# EAGLE design linear supply3_smd (EAGLE 9.6.2)
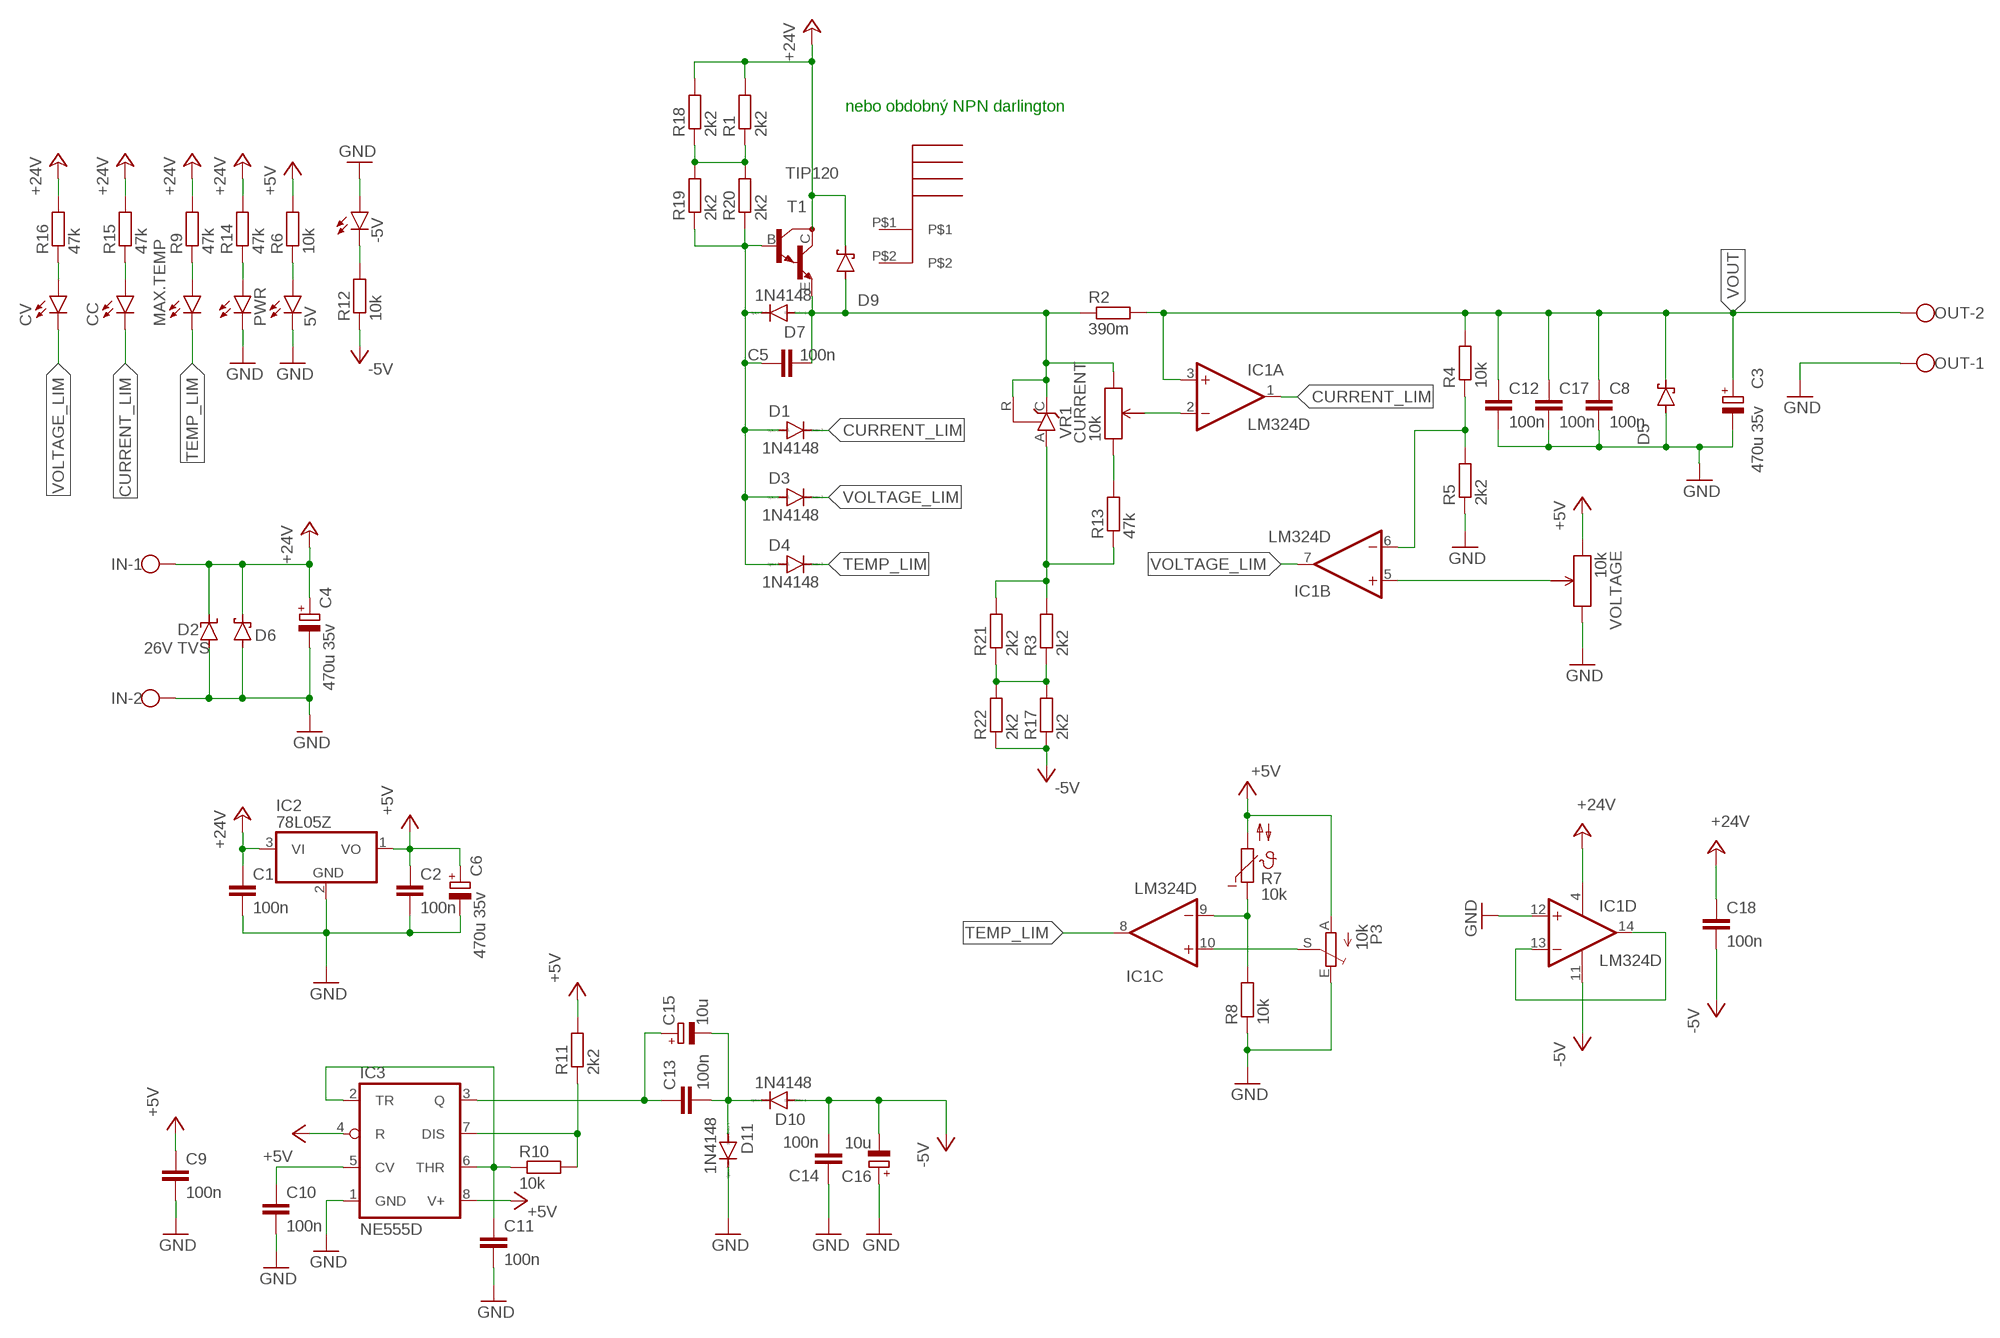
[diagram p0: schematic, sheet 1]

## Parts
5V  LEDCHIP-LED0805  [CHIP-LED0805]
-5V  LEDCHIP-LED0805  [CHIP-LED0805]
C1  100n  C-EUC0805  [C0805]
C2  100n  C-EUC0805  [C0805]
C3  470u 35v  CPOL-EUE5-10.5  [E5-10,5]
C4  470u 35v  CPOL-EUE5-10.5  [E5-10,5]
C5  100n  C-EUC0805  [C0805]
C6  470u 35v  CPOL-EUE5-10.5  [E5-10,5]
C8  100n  C-EU050-050X075  [C050-050X075]
C9  100n  C-EUC0805  [C0805]
C10  100n  C-EUC0805  [C0805]
C11  100n  C-EUC0805  [C0805]
C12  100n  C-EUC1206  [C1206]
C13  100n  C-EUC0805  [C0805]
C14  100n  C-EUC0805  [C0805]
C15  10u  CPOL-EUE2.5-6  [E2,5-6]
C16  10u  CPOL-EUE2.5-6  [E2,5-6]
C17  100n  C-EUC1206  [C1206]
C18  100n  C-EUC0805  [C0805]
CC  LEDCHIP-LED0805  [CHIP-LED0805]
CURRENT  10k  THRU_PCB_POTKASO1  [THRU_PCW_POT]
CV  LEDCHIP-LED0805  [CHIP-LED0805]
D1  1N4148  PMLL4150  [SOD80C]
D2  26V TVS  SUPPRESSOR-SMBJ  [SMBJ]
D3  1N4148  PMLL4150  [SOD80C]
D4  1N4148  PMLL4150  [SOD80C]
D5  SCHOTTKY-DIODESMC  [SMC]
D6  SCHOTTKY-DIODESMC  [SMC]
D7  1N4148  PMLL4150  [SOD80C]
D9  SCHOTTKY-DIODESMC  [SMC]
D10  1N4148  PMLL4150  [SOD80C]
D11  1N4148  PMLL4150  [SOD80C]
IC1  LM324D  [SO14]
IC2  78L05Z  [TO92]
IC3  NE555D  [SO08]
IN  W237-102  [W237-102]
MAX.TEMP  LEDCHIP-LED0805  [CHIP-LED0805]
OUT  W237-102  [W237-102]
P3  10k  TRIM_EU-CA6V  [CA6V]
PWR  LEDCHIP-LED0805  [CHIP-LED0805]
R1  2k2  R-EU_R0805  [R0805]
R2  390m  R-EU_0411/12  [0411/12]
R3  2k2  R-EU_R0805  [R0805]
R4  10k  R-EU_R0805  [R0805]
R5  2k2  R-EU_R0805  [R0805]
R6  10k  R-EU_R0805  [R0805]
R7  10k  V642  [P642]
R8  10k  R-EU_R0805  [R0805]
R9  47k  R-EU_R0805  [R0805]
R10  10k  R-EU_R0805  [R0805]
R11  2k2  R-EU_R0805  [R0805]
R12  10k  R-EU_R0805  [R0805]
R13  47k  R-EU_R0805  [R0805]
R14  47k  R-EU_R0805  [R0805]
R15  47k  R-EU_R0805  [R0805]
R16  47k  R-EU_R0805  [R0805]
R17  2k2  R-EU_R0805  [R0805]
R18  2k2  R-EU_R0805  [R0805]
R19  2k2  R-EU_R0805  [R0805]
R20  2k2  R-EU_R0805  [R0805]
R21  2k2  R-EU_R0805  [R0805]
R22  2k2  R-EU_R0805  [R0805]
T1  TIP120  BDV65  [SOT93]
U$1  RAD-DY-KY/3  [RAD-DY-KY/3HEATSINK]
VOLTAGE  10k  THRU_PCB_POTKASO1  [THRU_PCW_POT]
VR1  TL431CLP  [TO92-CLP]

## Nets
+5V: C2.1 C6.+ C9.1 IC2.1(VO) IC3.4(R) IC3.8(V+) P3.A R6.2 R7.2 R11.2 VOLTAGE.P$1
+24V: C1.1 C4.+ C18.1 D2.C D6.C D9.C IC1.4(P:V+) IC2.3(VI) IN.1 R1.2 R9.2 R14.2 R15.2 R16.2 R18.2 T1.C
-5V: C14.2 C16.- C18.2 D10.A IC1.11(P:V-) R12.1 R17.1 R22.1
CURRENT_LIM: CC.C D1.C IC1.1(A:OUT)
GND: 5V.C -5V.A C1.2 C2.2 C3.- C4.- C6.- C8.2 C9.2 C10.2 C11.2 C12.2 C14.1 C16.+ C17.2 D2.A D5.A D6.A D11.C IC1.12(D:+IN) IC2.2(GND) IC3.1(GND) IN.2 OUT.1 P3.E PWR.C R5.1 R8.1 VOLTAGE.P$3
MAX: R3.2 R13.1 R21.2 VR1.A
MIN: C5.2 CURRENT.P$3 D7.A D9.A R2.1 T1.E VR1.C VR1.R
N$1: C5.1 D1.A D3.A D4.A D7.C R19.1 R20.1 T1.B
N$2: PWR.A R14.1
N$3: C11.1 IC3.2(TR) IC3.6(THR) R10.1
N$4: IC1.9(C:-IN) R7.1 R8.2
N$5: IC1.6(B:-IN) R4.1 R5.2
N$6: 5V.A R6.1
N$7: IC1.5(B:+IN) VOLTAGE.P$2
N$8: IC1.10(C:+IN) P3.S
N$9: CURRENT.P$2 IC1.2(A:-IN)
N$10: MAX.TEMP.A R9.1
N$11: IC1.13(D:-IN) IC1.14(D:OUT)
N$12: IC3.7(DIS) R10.2 R11.1
N$13: C13.1 C15.+ IC3.3(Q)
N$14: C10.1 IC3.5(CV)
N$15: C13.2 C15.- D10.C D11.A
N$16: -5V.C R12.2
N$17: CURRENT.P$1 R13.2
N$18: CC.A R15.1
N$19: CV.A R16.1
N$23: R1.1 R18.1 R19.2 R20.2
N$26: R3.1 R17.2 R21.1 R22.2
TEMP_LIM: D4.C IC1.8(C:OUT) MAX.TEMP.C
VOLTAGE_LIM: CV.C D3.C IC1.7(B:OUT)
VOUT: C3.+ C8.1 C12.1 C17.1 D5.C IC1.3(A:+IN) OUT.2 R2.2 R4.2
Unconnected: U$1.P$1 U$1.P$2

## Notes on the sheet
- nebo obdobný NPN darlington

## Library data of the parts
5V -5V CC CV MAX.TEMP PWR = led:LED: LED OSRAM: - CHIPLED LG R971, LG N971, LY N971, LG Q971, LY Q971, LO R971, LY R971 LH N974, LH R974 LS Q976, LO Q976, LY Q976 LO Q996 - Hyper CHIPLED LW Q18S LB Q993, LB Q99A, LB R99A - SideLED LS A670, LO A670, LY A670, LG A670, LP A670 LB A673, LV A673, LT A673, LW A673 LH A674 LY A675 LS A676, LA A676, LO A676, LY A676, LW A676 LS A679, LY A679, LG A679 - Hyper Micro SIDELED® LS Y876, LA Y876, LO Y876, LY Y876 LT Y87S - SmartLED LW L88C, LW L88S LB L89C, LB L89S, LG L890 LS L89K, LO L89K, LY L89K LS L896, LA L896, LO L896, LY L896 - TOPLED LS T670, LO T670, LY T670, LG T670, LP T670 LSG T670, LSP T670, LSY T670, LOP T670, LYG T670 LG T671, LOG T671, LSG T671 LB T673, LV T673, LT T673, LW T673 LH T674 LS T676, LA T676, LO T676, LY T676, LB T676, LH T676, LSB T676, LW T676 LB T67C, LV T67C, LT T67C, LS T67K, LO T67K, LY T67K, LW E67C LS E67B, LA E67B, LO E67B, LY E67B, LB E67C, LV E67C, LT E67C LW T67C LS T679, LY T679, LG T679 LS T770, LO T770, LY T770, LG T770, LP T770 LB T773, LV T773, LT T773, LW T773 LH T774 LS E675, LA E675, LY E675, LS T675 LS T776, LA T776, LO T776, LY T776, LB T776 LHGB T686 LT T68C, LB T68C - Hyper Mini TOPLED® LB M676 - Mini TOPLED Santana® LG M470 LS M47K, LO M47K, LY M47K Source: http://www.osram.convergy.de LUXEON: - LUMILED® LXK2-PW12-R00, LXK2-PW12-S00, LXK2-PW14-U00, LXK2-PW14-V00 LXK2-PM12-R00, LXK2-PM12-S00, LXK2-PM14-U00 LXK2-PE12-Q00, LXK2-PE12-R00, LXK2-PE12-S00, LXK2-PE14-T00, LXK2-PE14-U00 LXK2-PB12-K00, LXK2-PB12-L00, LXK2-PB12-M00, LXK2-PB14-N00, LXK2-PB14-P00, LXK2-PB14-Q00 LXK2-PR12-L00, LXK2-PR12-M00, LXK2-PR14-Q00, LXK2-PR14-R00 LXK2-PD12-Q00, LXK2-PD12-R00, LXK2-PD12-S00 LXK2-PH12-R00, LXK2-PH12-S00 LXK2-PL12-P00, LXK2-PL12-Q00, LXK2-PL12-R00 Source: www.luxeon.com KINGBRIGHT: KA-3528ASYC Source: www.kingbright.com
C1 C2 C5 C8-C14 C17 C18 = rcl:C-EU: CAPACITOR, European symbol; SPICEPREFIX: C
C3 C4 C6 C15 C16 = rcl:CPOL-EU: POLARIZED CAPACITOR, European symbol; SPICEPREFIX: C
CURRENT = SamacSys_Parts:THRU_PCB_POT
D1 D3 D4 D7 D10 D11 = diode:PMLL4150: DIODE high speed
D2 = diode:SUPPRESSOR-: Suppressor diode
D5 D6 D9 = diode:SCHOTTKY-DIODE: Schottky Diode
IC1 = linear:LM324: OP AMP
IC2 = linear:78*: Positive VOLTAGE REGULATOR Source: http://cache.national.com/ds/LM/LM78L05.pdf http://www.fairchildsemi.com/ds/LM/LM7805.pdf
IC3 = linear:*555: TIMER
IN OUT = con-wago-500:W237-102: WAGO SCREW CLAMP; MPN: 237-102; OC_FARNELL: unknown; OC_NEWARK: 70K9898
P3 = pot:TRIM_EU-: POTENTIOMETER
R1-R6 R8-R22 = rcl:R-EU_: RESISTOR, European symbol; SPICEPREFIX: R
R7 = ptc-ntc:V642: VALVO NTC; OC_FARNELL: unknown; OC_NEWARK: unknown
T1 = transistor-neu-to92:BDV65: NPN BIPOLAR DARLINGTON TRANSISTOR
U$1 = SamacSys_Parts:RAD-DY-KY/3
VOLTAGE = SamacSys_Parts:THRU_PCB_POT; SPICEPREFIX: J
VR1 = v-reg:TL431CLP: VOLTAGE REGULATOR

## Board
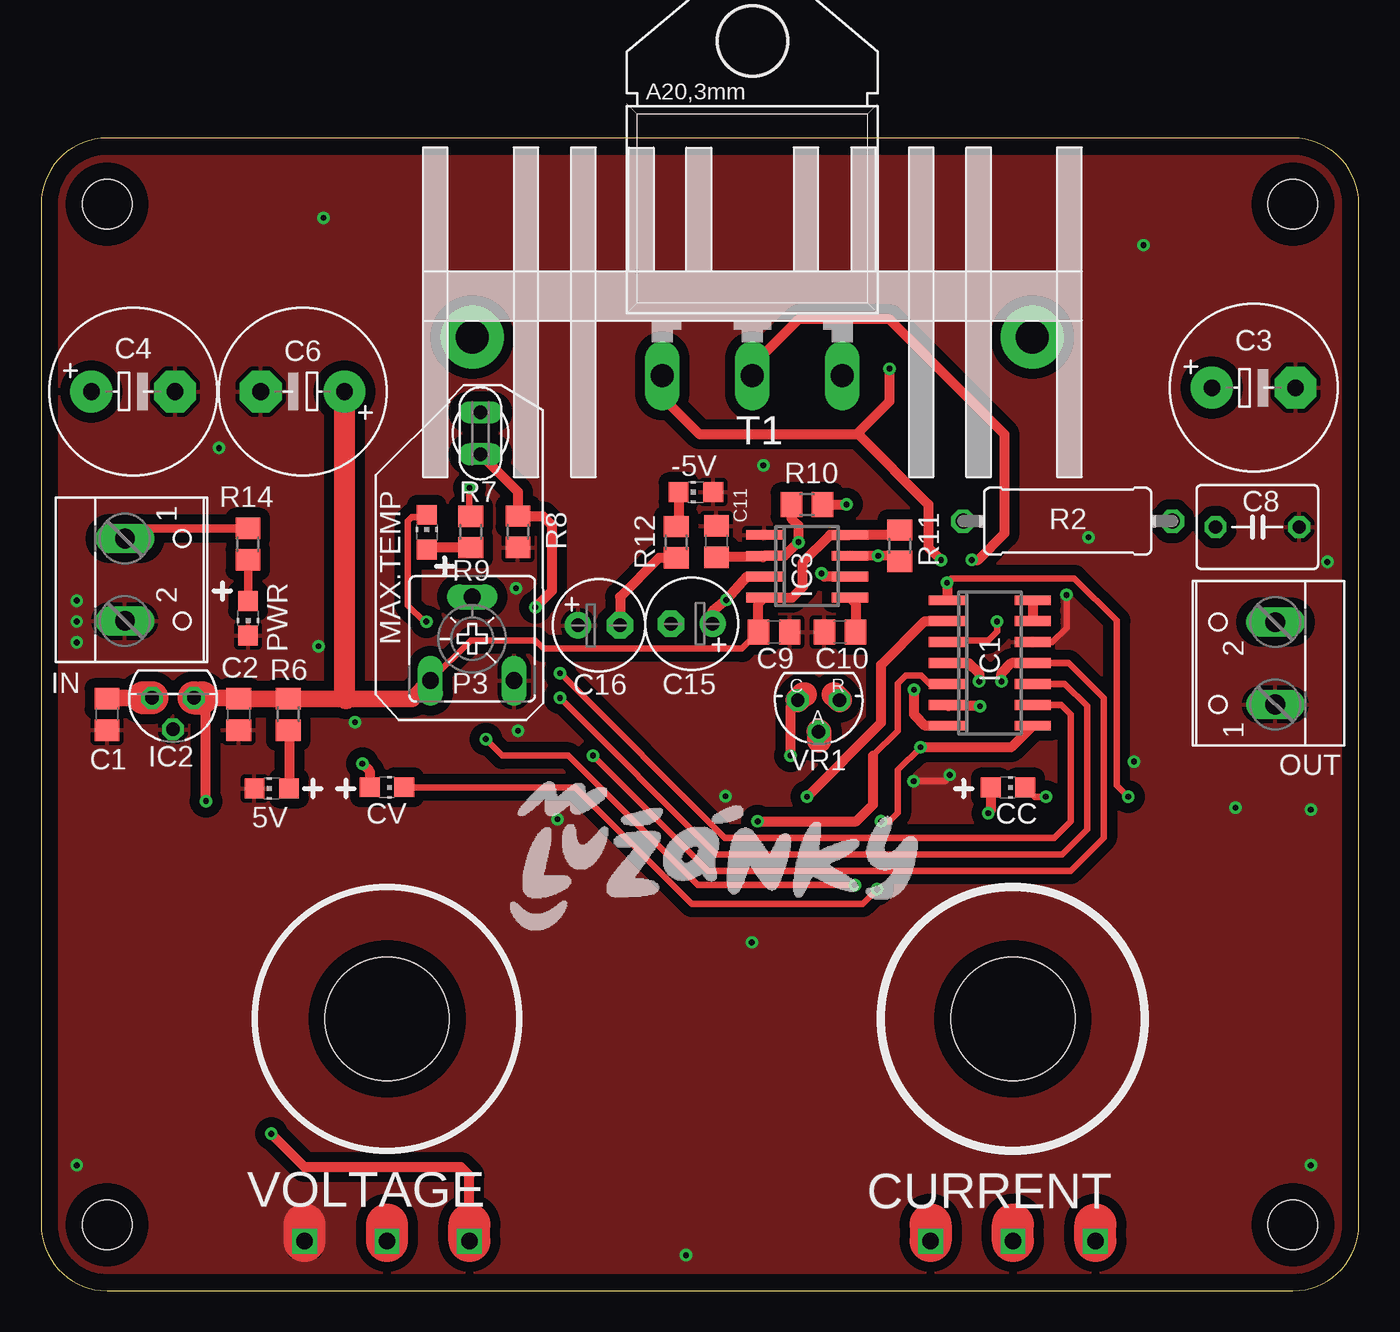
[diagram p1: board, top side]
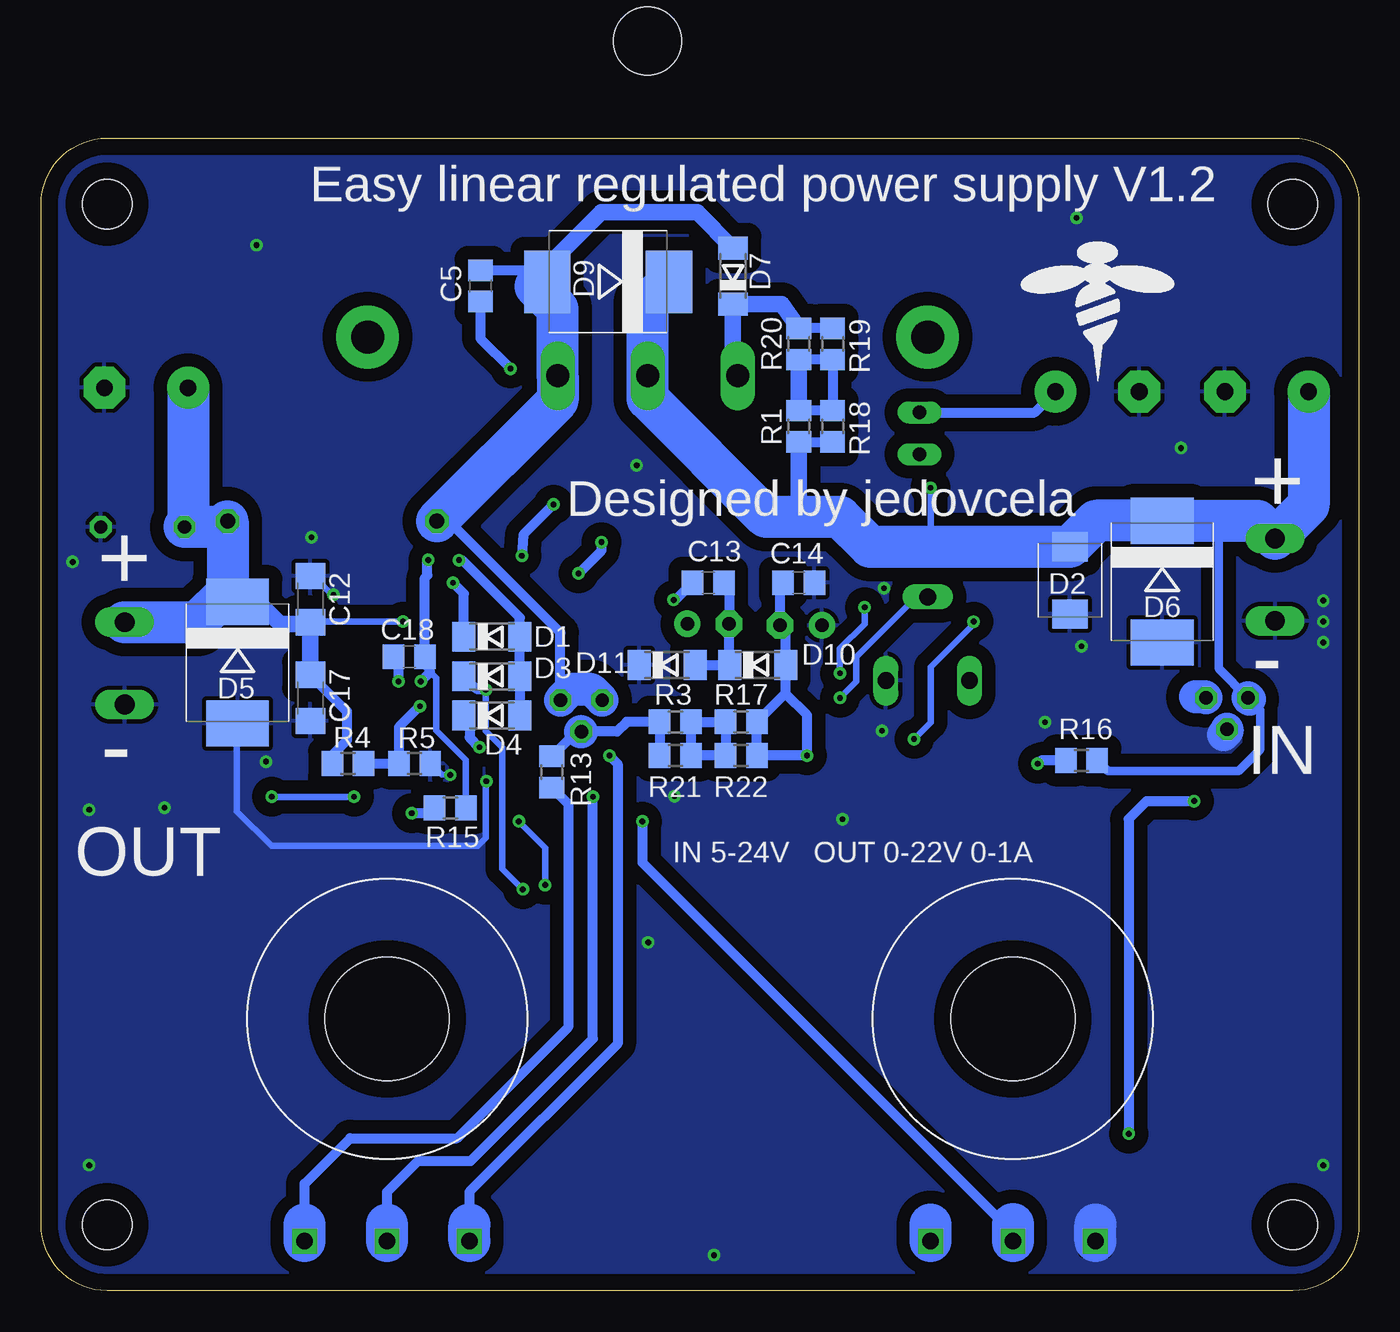
[diagram p2: board, bottom side, seen from below]

Size 80 x 70 mm. Coordinates in mm from the lower left corner, seen from the top.
Outline: 0,66 0,4 arc90 4,0 76,0 arc90 80,4 80,66 arc90 76,70 4,70 arc90 0,66
Copper layers (1*16): Top 0.035mm / dielectric 1.5mm / Bottom 0.035mm
Design rules "default *": minimum track width 6mil, minimum drill 0.35mm, track to track 6mil, track to pad 6mil, pad to pad 6mil, via to via 6mil, smd to smd 6mil, copper to edge 40mil, drill to drill 6mil, minimum pad ring 10mil, minimum via ring 8mil, stop-mask expansion 4mil, vias tented up to drill 15mil, thermal gap 10mil
Holes 3 mm at 4,4 76,4 76,66 4,66

### Footprints (pad centres in the part's own frame; a part is rotated, then mirrored left to right if it is on the bottom)
CHIP-LED0805 = smd 1.2 x 1.2: A 0,-1.05; C 0,1.05
C0805 = smd 1.3 x 1.5: 1 -0.95,0; 2 0.95,0
E5-10,5 = drill 1.016 pad 2.54: + -2.54,0 | drill 1.016 pad 2.54 octagon: - 2.54,0
C050-050X075 = drill 0.813 octagon: 1 -2.54,0; 2 2.54,0
C1206 = smd 1.6 x 1.8: 1 -1.4,0; 2 1.4,0
E2,5-6 = drill 0.813 pad 1.6: + -1.27,0 | drill 0.813 pad 1.6 octagon: - 1.27,0
THRU_PCW_POT = drill 1 square: P$1 -5,-13.5; P$2 0,-13.5; P$3 5,-13.5 | hole 7.5: 0,0
SOD80C = smd 1.4 x 1.8: A 1.7,0; C -1.7,0
SMBJ = smd 1.78 x 2.16: A 2.04,0; C -2.03,0
SMC = smd 2.8 x 3.8: A 3.7,0; C -3.7,0
SO14 = smd 0.6 x 2.2: 1 -3.81,-2.6; 2 -2.54,-2.6; 3 -1.27,-2.6; 4 0,-2.6; 5 1.27,-2.6; 6 2.54,-2.6; 7 3.81,-2.6; 8 3.81,2.6; 9 2.54,2.6; 10 1.27,2.6; 11 0,2.6; 12 -1.27,2.6; 13 -2.54,2.6; 14 -3.81,2.6
TO92 = drill 0.813 octagon: 1 -1.27,0; 2 0,1.905; 3 1.27,0
SO08 = smd 0.6 x 2.2: 1 -1.905,-2.6; 2 -0.635,-2.6; 3 0.635,-2.6; 4 1.905,-2.6; 5 1.905,2.6; 6 0.635,2.6; 7 -0.635,2.6; 8 -1.905,2.6
W237-102 = drill 1.194 long: 1 -2.5,-1.27; 2 2.5,-1.27
CA6V = drill 1.016 long: A -2.54,-2.54; E 2.54,-2.54; S 0,2.54
R0805 = smd 1.3 x 1.5: 1 -0.95,0; 2 0.95,0
0411/12 = drill 0.914 octagon: 1 -6.35,0; 2 6.35,0
P642 = drill 0.813 long: 1 -1.27,0; 2 1.27,0
SOT93 = drill 1.397 long: B -5.461,-10.16; C 0,-10.16; E 5.461,-10.16 | hole 4.115: 0,10.16
RAD-DY-KY/3HEATSINK = drill 2 pad 3.81: P$1 -17,-0.5; P$2 17,-0.5
TO92-CLP = drill 0.813 octagon: A 0,1.905; C 1.27,0; R -1.27,0

### Placement (x,y rotation side)
5V  14,30.5 90 top
-5V  39.75,48.5 90 top
C1  4,35 270 top
C2  12,35 270 top
C3  73.62,54.84 0 top
C4  5.59,54.61 0 top
C5  53.33,61.03 90 bottom
C6  15.88,54.61 180 top
C8  73.84,46.38 0 top
C9  44.5,40 0 top
C10  48.5,40 180 top
C11  41,45.5 90 top
C12  63.65,42 90 bottom
C13  39.5,43 0 bottom
C14  34,43 180 bottom
C15  39.5,40.5 180 top
C16  33.87,40.41 0 top
C17  63.65,36 270 bottom
C18  57.65,38.5 180 bottom
CC  58.7,30.56 270 top
CURRENT  59,16.5 0 bottom
CV  21,30.57 270 top
D1  52.64,39.72 0 bottom
D2  17.54,43.14 270 bottom
D3  52.64,37.31 0 bottom
D4  52.64,34.93 0 bottom
D5  68.08,38.14 270 bottom
D6  11.94,43.06 270 bottom
D7  38,61.63 90 bottom
D9  45.58,61.28 180 bottom
D10  36.5,38 0 bottom
D11  42,38 0 bottom
IC1  57.6,38.12 270 top
IC2  8,36 180 top
IC3  46.5,44 270 top
IN  6.35,43.18 270 top
MAX.TEMP  23.42,46.07 0 top
OUT  73.66,38.1 90 top
P3  26.17,39.59 0 top
PWR  12.56,40.84 180 top
R1  34,52.5 270 bottom
R2  62.33,46.74 0 top
R3  41.5,34.55 180 bottom
R4  61.37,32.02 180 bottom
R5  57.33,32.02 180 bottom
R6  15,35 90 top
R7  26.67,52.07 90 top
R8  28.95,46.09 90 top
R9  26.09,46.08 90 top
R10  46.5,47.75 0 top
R11  52.13,45.25 90 top
R12  38.56,45.46 90 top
R13  49,31.5 270 bottom
R14  12.55,45.34 90 top
R15  55.16,29.32 0 bottom
R16  16.84,32.2 0 bottom
R17  37.5,34.55 180 bottom
R18  31.95,52.5 270 bottom
R19  31.95,57.5 270 bottom
R20  34,57.5 270 bottom
R21  41.5,32.5 180 bottom
R22  37.5,32.5 180 bottom
T1  43.18,65.73 0 top
U$1  43.18,58.42 0 top
VOLTAGE  21,16.5 0 bottom
VR1  47.21,35.86 180 top

### Tracks (layer width: path | path; a pad name or v marks a point on that pad's centre or on a via)
+5V  (via drill 0.35)
  Top 0.406: C9.1 42.55,39 30.5,39 30,39.5 26.08,39.5 P3.A
  Top 0.61: R11.2 51.77,46.2 51.48,45.91 IC3.8 47.91,45.91 46.25,44.25 46.25,42.75 45.59,42.09 IC3.4 43.55,41.74 C9.1 | IC2.1 10,35.27 v10,29.74 | VOLTAGE.P$1 26,7 25.5,7.5 16,7.5 v13.97,9.53
  Top 1.016: 9.78,36 11.95,36 C2.1 R6.2 18.5,35.95 22.53,35.95 P3.A
  Top 1.27: C6.+ 18.41,36.03 18.5,35.95
  Top 2: IC2.1 9.78,36
  Top 2.54: VOLTAGE.P$1 26,4
  Bottom 0.61: R7.2 19.68,53.34 C6.+ | v10,29.74 12.88,29.74 13.97,28.65 v13.97,9.53
  Bottom 2: IC2.1 9.34,36.07 9.91,36.07
  Bottom 2.54: VOLTAGE.P$1 26,4
+24V  (via drill 0.35)
  Top 0.406: R9.2 26,47.12 v26,48.76
  Top 0.508: R14.2 5.69,46.29 IN.1
  Top 0.61: v56.5,44.38 56.88,44.38 58.5,46 58.5,52 51.5,59 46,59 43.18,56.18 T1.C | IC1.4 56.33,38.12 56.95,37.5 v56.95,37
  Top 1.016: C1.1 4.05,36 6.22,36
  Top 2: IC2.3 6.22,36
  Bottom 0.406: 56.5,43.5 56.55,43.45 56.7,43.3 | v26,48.76 26,45.17 | R15.2 54.21,32.24 56,34.03 56,37.2 56.4,37.6 56.7,37.9 C18.1
  Bottom 0.508: R16.2 15.26,31.57 7.29,31.57 5.99,32.87 5.99,35.26 6.64,35.91 | IC2.3 8.51,37.78 8.51,46.76
  Bottom 0.61: C18.1 56.7,43.3 | 56.55,43.45 56.55,44.33 v56.5,44.38 | R1.2 R18.2 | v56.95,37 56.4,37.55 56.4,37.6
  Bottom 1.016: R1.2 34,47
  Bottom 2: IC2.3 6.64,35.91
  Bottom 2.54: D9.C 43.18,59.98 T1.C 43.18,54.18 36,47 34,47 31.5,47 29.67,45.17 26,45.17 D2.C 15.95,46.76 D6.C 8.51,46.76 6.16,46.76 IN.1 3.05,47.71 C4.+
-5V  (via drill 0.35)
  Top 0.406: IC1.11 62.38,38.12 64.5,36 64.5,27.5 62.5,25.5 40.5,25.5 v33.5,32.5
  Top 0.61: R12.1 37.5,44.5 35.14,42.14 C16.- | v58.3,37 58.3,37.5 58.91,38.11 60.19,38.11 IC1.11
  Bottom 0.406: v33.5,32.5 33.73,32.5
  Bottom 0.61: C14.2 35.14,42.81 C16.- 34.8,40.06 D10.A 34.8,36.3 | 34.8,36.3 R17.1 R22.1 v33.5,32.5 33.5,34.95 34.8,36.25 34.8,36.3 | v58.3,37 58.3,38.2 C18.2
CURRENT_LIM  (via drill 0.35)
  Top 0.406: CC.C 60.31,30 v61,30 | v66,30 65.31,30.69 65.31,40.69 62.73,43.27 55.27,43.27 v55,43
  Top 0.61: v55,43 IC1.1
  Bottom 0.406: v61,30 v66,30
  Bottom 0.61: D1.C 54.34,42.34 v55,43
GND  (via drill 0.35)
  Top 0.406: v55.16,31.32 54.88,30.94 v52.98,30.94 | IC1.12 61.39,39.39 62.25,40.25 v62.25,42.25
  Top 2.54: VOLTAGE.P$3 16,4
  Bottom 0.406: v52.98,30.94 53,30.92 53,27.5 53.5,27 66,27 68.12,29.12 68.12,34.4 D5.A | R5.1 55.69,31.34 v55.16,31.32 | v62.25,42.25 62.31,42.25 63.46,43.4 C12.2
  Bottom 2: IC2.2 8,33.99 8.23,33.76
  Bottom 2.54: VOLTAGE.P$3 16,4
  other vias: 19.05,34.52 10.79,51.18 2.16,41.91 2.16,40.64 2.16,39.37 66.93,63.5 78.09,44.26 77.09,29.21 17.14,65.15 77.09,7.62 2.16,7.62 28.95,34.01 72.52,29.34 63.59,45.76 66.34,32.13 16.84,39.13 31.34,28.63 41.54,30.03 43.84,50.13 28.82,42.66 43.15,21.15 39.15,2.15
  pour Top (isolate 0.61): 0,0 0,69.85 80.01,69.85 80.01,0
  pour Bottom (isolate 0.813): 0,0 0,69.85 80.01,69.85 80.01,0
MAX
  Top 1.5: VR1.A 47.24,33.92 47.24,33.4
  Bottom 0.61: VR1.A 45.05,33.95 44.45,34.55 R3.2 R21.2 | R13.1 47.49,33.95 47.24,33.95
  Bottom 2: VR1.A 47.24,33.95
MIN  (via drill 0.35)
  Top 0.61: v45.5,32.5 45.5,35.42 VR1.C
  Top 1.5: VR1.C 46.27,36.2 46.35,36.2 | VR1.R 48.14,36.2 48.13,36.2
  Top 2.54: 54,4 CURRENT.P$3
  Bottom 0.61: VR1.R 48.48,39.96 55.25,46.74 R2.1 | C5.2 49.52,61.98 49.5,62 | v45.5,32.5 45,32 45,15 54,6 CURRENT.P$3
  Bottom 1.016: D7.A 40.17,65.5 46,65.5 49.5,62 50,61.5 50,61
  Bottom 2: VR1.C 46.58,36.5 47.84,36.5 VR1.R
  Bottom 2.54: R2.1 48.64,54.07 T1.E 48.64,59.64 50,61 49.72,61.28 D9.A | CURRENT.P$3 54,4
N$1  (via drill 0.35)
  Top 0.61: v54.63,44.37 53.87,45.13 53.87,47.75 49.63,52 49.5,52 | T1.B 37.72,54.28 40,52 49.5,52 | v51.5,56 51.5,54 49.5,52
  Bottom 0.61: D4.A D3.A D1.A 50.94,40.88 54.44,44.37 v54.63,44.37 | C5.1 53.33,57.83 v51.5,56 | R19.1 R20.1
  Bottom 1.016: R20.1 35.03,59.93 D7.C 38,55.85 T1.B
N$2
  Top 0.508: R14.1 PWR.A
N$3  (via drill 0.35)
  Top 0.61: C11.1 43.81,44.55 IC3.2 45.14,44.63 v45.97,45.47 45.97,46.48 45.55,46.91 R10.1 | IC3.6 47.57,43.37 v47.37,43.56
  Bottom 0.61: v47.37,43.56 45.97,44.96 v45.97,45.47
N$4  (via drill 0.35)
  Top 0.406: IC1.9 61.92,35.58 62.5,35 62.5,28.5 61.5,27.5 41.5,27.5 v31.5,37.5
  Top 0.61: R7.1 28.95,48.52 R8.2 30.45,47.05 31,46.5 31,42.5 v30,41.5
  Bottom 0.406: v30,41.5 30,40.5 31.5,39 v31.5,37.5
N$5  (via drill 0.35)
  Top 0.61: v57,35.5 55.08,35.5 IC1.6
  Bottom 0.61: R4.1 R5.2 58.28,34.22 v57,35.5
N$6
  Top 0.61: R6.1 15.05,34 5V.A
N$7  (via drill 0.35)
  Top 0.406: IC1.5 53.95,36.85 53.44,37.37 52.5,37.37 52,36.87 52,34 50.5,32.5
  Top 0.61: v43.5,28.5 49.5,28.5 50.5,29.5 50.5,32.5
  Top 2.54: VOLTAGE.P$2 21,4
  Bottom 0.61: v43.5,28.5 43.5,26 21.55,4.05 21,4.05
  Bottom 1.8: VOLTAGE.P$2 21,3.5
  Bottom 2.54: 21,4.05 VOLTAGE.P$2
N$8  (via drill 0.35)
  Top 0.406: IC1.10 62.15,36.85 63.5,35.5 63.5,28 62,26.5 41,26.5 v31.5,36
  Bottom 0.406: v31.5,36 30.5,37 30.5,38.5 26.87,42.13 P3.S
N$9  (via drill 0.35)
  Top 0.61: IC1.2 53.66,40.66 51,38 51,34.5 v46.5,30
  Top 2.54: CURRENT.P$2 59,4
  Bottom 0.61: 59,4 59,6 57.12,7.88 53.92,7.88 46.5,15.3 v46.5,30
  Bottom 2.54: CURRENT.P$2 59,4
N$10
  Top 0.61: R9.1 23.53,45.13 MAX.TEMP.A
N$11
  Top 0.61: IC1.14 IC1.13
N$12  (via drill 0.35)
  Top 0.61: R10.2 v48.89,47.75 v48.9,47.75 | IC3.7 v50.81,44.63 51.79,44.63 R11.1
  Bottom 0.61: v48.9,47.75 50.73,45.92 v50.81,44.63 50.75,44.63
N$13  (via drill 0.35)
  Top 0.61: IC3.3 42.87,43.37 v41.6,41.95 40.77,41.27 C15.+
  Bottom 0.61: C13.1 41.45,42 v41.6,41.95
N$14
  Top 0.61: IC3.5 49.45,41.74 C10.1
N$15
  Bottom 0.61: C13.2 38.23,42.68 C15.- 38.23,38.03 | D10.C 38.23,38.03 | D11.A 38.26,38 38.23,38.03
N$16
  Top 0.61: -5V.C 38.7,46.55 R12.2
N$17
  Top 2.54: CURRENT.P$1 64,4
  Bottom 0.61: 64,4 64,6.5 61.25,9.25 54.75,9.25 48,16 48,29.55 R13.2
  Bottom 2.54: CURRENT.P$1 64,4
N$18  (via drill 0.35)
  Top 0.61: CC.A 57.65,29.15 v57.5,29
  Bottom 0.61: v57.5,29 56.43,29 R15.1
N$19  (via drill 0.35)
  Top 0.61: v19.5,32 19.95,31.55 CV.A
  Bottom 0.61: R16.1 19.3,32.2 v19.5,32
N$23
  Bottom 0.61: R1.1 R18.1 R19.2 R20.2
  Bottom 1.016: R1.1 R20.2
N$26
  Bottom 0.61: R3.1 R17.2 R22.2 R21.1 R3.1
TEMP_LIM  (via drill 0.35)
  Top 0.406: v53.39,33 52,31.61 52,29 51.5,28.5 v51,28.5 | MAX.TEMP.C 23.3,47 22.51,47 22.26,46.75 22.26,41.63 23.25,40.63 v23.38,40.63 | v49.4,24.64 39.86,24.64 32,32.5 28,32.5 v27,33.5
  Top 0.61: IC1.8 58.89,33 v53.39,33
  Bottom 0.406: v23.38,40.63 23.38,40.49 26,37.87 26,34.5 v27,33.5 | v51,28.5 49.4,26.9 v49.4,24.64
  Bottom 0.61: D4.C 53.99,34.58 53.99,33.6 v53.39,33
VOLTAGE_LIM  (via drill 0.35)
  Top 0.406: v50.75,24.37 49.88,23.5 39.5,23.5 32.43,30.57 CV.C
  Top 0.61: IC1.7 53.69,34.31 53,35 v53,36.49
  Bottom 0.406: v53,36.49 53,34 52,33 52,25.62 v50.75,24.37
  Bottom 0.61: v53,36.49 53.06,36.55 53.58,36.55 D3.C
VOUT  (via drill 0.35)
  Top 0.406: IC1.3 55.11,39.5 57.5,39.5 58.04,40.04 v58.04,40.64
  Bottom 0.406: v58.04,40.64 63.61,40.64 C12.1
  Bottom 0.61: R4.2 62.32,32.53 61.43,33.42 61.43,35.18 C17.1
  Bottom 1.016: C17.1 C12.1 63.75,40.5 65.5,40.5 66.84,41.84 D5.C
  Bottom 2.54: 68.67,42.44 R2.2 69.03,46.38 C8.1 71.08,46.6 C3.+ | 68.67,42.44 D5.C | OUT.2 70.51,40.6 68.67,42.44

### Text on the board
tNames: VOLTAGE | CURRENT
bNames: Easy linear regulated power supply V1.2 | + | Designed by jedovcela | + | - | IN | - | IN 5-24V OUT 0-22V 0-1A | OUT